# EAGLE design bus-blaster-case (EAGLE 5.11)
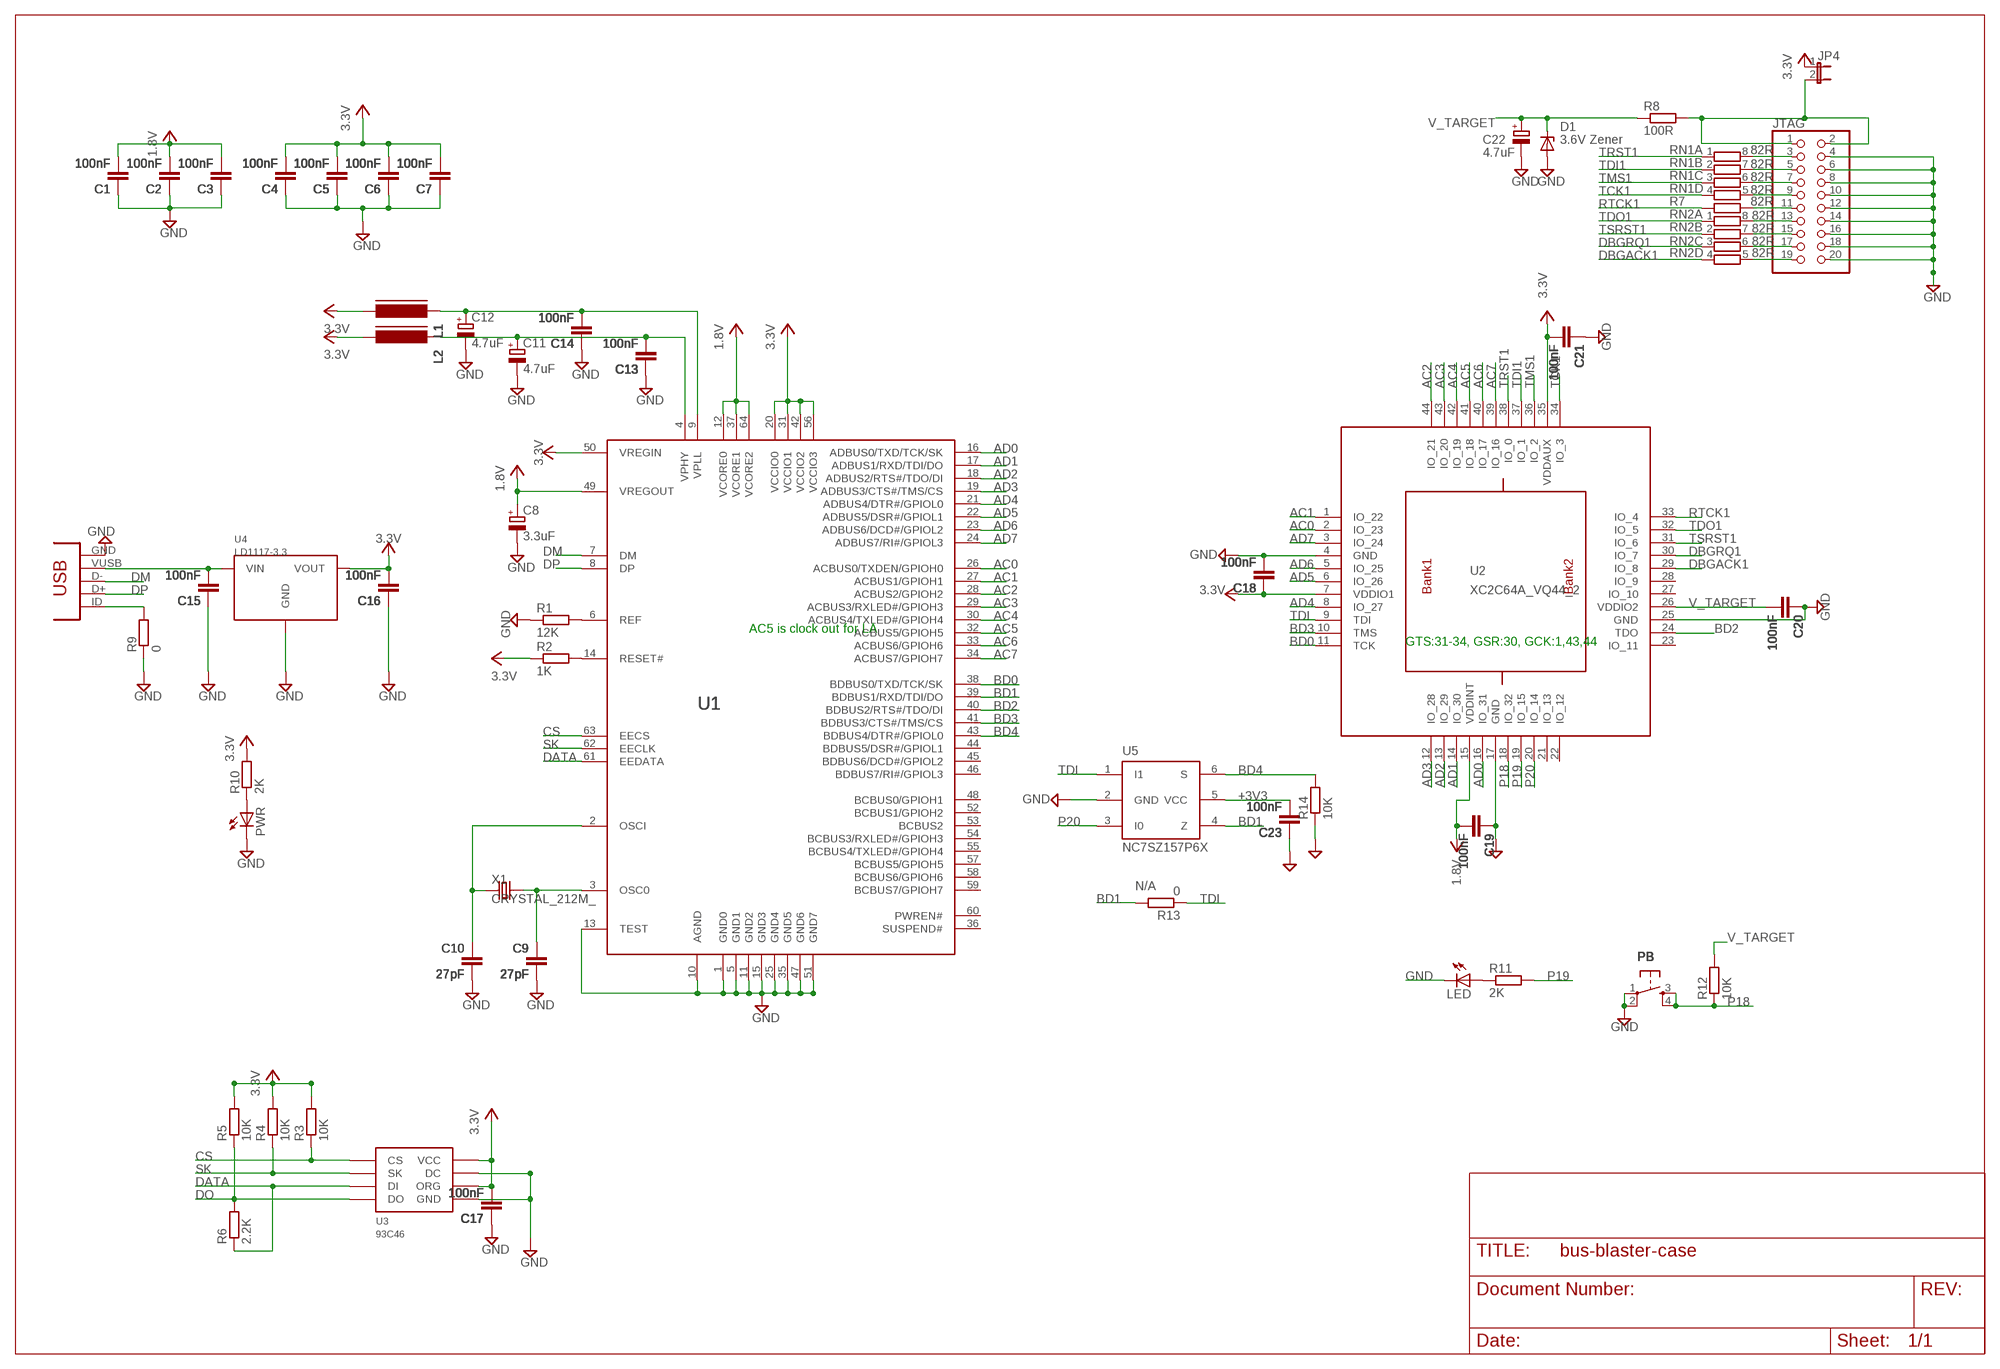
[diagram p0: schematic, sheet 1]

## Parts
C1  100nF  CAPC603  [C603]
C2  100nF  CAPC603  [C603]
C3  100nF  CAPC603  [C603]
C4  100nF  CAPC603  [C603]
C5  100nF  CAPC603  [C603]
C6  100nF  CAPC603  [C603]
C7  100nF  CAPC603  [C603]
C8  3.3uF  CAP_POLSMC_A  [SMC_A]
C9  27pF  CAPC603  [C603]
C10  27pF  CAPC603  [C603]
C11  4.7uF  CAP_POLSMC_A  [SMC_A]
C12  4.7uF  CAP_POLSMC_A  [SMC_A]
C13  100nF  CAPC603  [C603]
C14  100nF  CAPC603  [C603]
C15  100nF  CAPC603  [C603]
C16  100nF  CAPC603  [C603]
C17  100nF  CAPC603  [C603]
C18  100nF  CAPC603  [C603]
C19  100nF  CAPC603  [C603]
C20  100nF  CAPC603  [C603]
C21  100nF  CAPC603  [C603]
C22  4.7uF  CAP_POLSMC_A  [SMC_A]
C23  100nF  CAPC603  [C603]
D1  3.6V Zener  ZENERSOD-123  [SOD-123]
JP4  JP1E  [JP1]
JTAG  PINHD-2X10-SMD-INLINE  [PINHD-2X10-SMD-INLINE]
L1  FERRITE_BEAD603  [FB603]
L2  FERRITE_BEAD603  [FB603]
LED  LED3MM  [LED3MM]
PB  SW-SMD-SMALL  [TACT_SWITCH_SMALL]
PWR  LED3MM  [LED3MM]
R1  12K  RESISTORR603  [R603]
R2  1K  RESISTORR603  [R603]
R3  10K  RESISTORR603  [R603]
R4  10K  RESISTORR603  [R603]
R5  10K  RESISTORR603  [R603]
R6  2.2K  RESISTORR603  [R603]
R7  82R  RESISTORR603  [R603]
R8  100R  RESISTORR1206  [R1206]
R9  0  RESISTORR603  [R603]
R10  2K  RESISTORR603  [R603]
R11  2K  RESISTORR603  [R603]
R12  10K  RESISTORR603  [R603]
R13  0  RESISTORR603  [R603]
R14  10K  RESISTORR603  [R603]
RN1  82R  RNETWORK  [RN8P-4R-CRA06S]
RN2  82R  RNETWORK  [RN8P-4R-CRA06S]
U1  FT2232H  [LQFP64]
U2  XC2C64A_VQ44_2  [VQ44]
U3  93C46  [SOIC8]
U4  LD1117-3.3  [SOT223]
U5  NC7SZ157P6X  [SC70]
USB  CON-USB-MINI-BUSB1  [CONN_USB_MINI-B]
X1  CRYSTAL_212M_  [4X6]

## Nets
1.8V: C1.2 C2.2 C3.2 C8.+ C19.2 U1.12(VCORE0) U1.37(VCORE1) U1.49(VREGOUT) U1.64(VCORE2) U2.15(VDDINT)
+3V3: C4.2 C5.2 C6.2 C7.2 C16.2 C17.2 C18.1 C21.2 C23.2 JP4.1 L1.2 L2.2 R2.1 R3.2 R4.2 R5.2 R10.2 U1.20(VCCIO0) U1.31(VCCIO1) U1.42(VCCIO2) U1.50(VREGIN) U1.56(VCCIO3) U2.7(VDDIO1) U2.35(VDDAUX) U3.6(ORG) U3.8(VCC) U4.2(VOUT) U5.5(VCC) ; supply symbol labelled 3.3V
AC0: U1.26(ACBUS0/TXDEN/GPIOH0) U2.2(IO_23)
AC1: U1.27(ACBUS1/GPIOH1) U2.1(IO_22)
AC2: U1.28(ACBUS2/GPIOH2) U2.44(IO_21)
AC3: U1.29(ACBUS3/RXLED#/GPIOH3) U2.43(IO_20)
AC4: U1.30(ACBUS4/TXLED#/GPIOH4) U2.42(IO_19)
AC5: U1.32(ACBUS5/GPIOH5) U2.41(IO_18)
AC6: U1.33(ACBUS6/GPIOH6) U2.40(IO_17)
AC7: U1.34(ACBUS7/GPIOH7) U2.39(IO_16)
AD0: U1.16(ADBUS0/TXD/TCK/SK) U2.16(IO_31)
AD1: U1.17(ADBUS1/RXD/TDI/DO) U2.14(IO_30)
AD2: U1.18(ADBUS2/RTS#/TDO/DI) U2.13(IO_29)
AD3: U1.19(ADBUS3/CTS#/TMS/CS) U2.12(IO_28)
AD4: U1.21(ADBUS4/DTR#/GPIOL0) U2.8(IO_27)
AD5: U1.22(ADBUS5/DSR#/GPIOL1) U2.6(IO_26)
AD6: U1.23(ADBUS6/DCD#/GPIOL2) U2.5(IO_25)
AD7: U1.24(ADBUS7/RI#/GPIOL3) U2.3(IO_24)
BD0: U1.38(BDBUS0/TXD/TCK/SK) U2.11(TCK)
BD1: R13.2 U1.39(BDBUS1/RXD/TDI/DO) U5.4(Z)
BD2: U1.40(BDBUS2/RTS#/TDO/DI) U2.24(TDO)
BD3: U1.41(BDBUS3/CTS#/TMS/CS) U2.10(TMS)
BD4: R14.2 U1.43(BDBUS4/DTR#/GPIOL0) U5.6(S)
CS: R3.1 U1.63(EECS) U3.1(CS)
DATA: R6.1 U1.61(EEDATA) U3.3(DI)
DBGACK1: RN2.4 U2.29(IO_8)
DBGRQ1: RN2.3 U2.30(IO_7)
DM: U1.7(DM) USB.D-
DO: R5.1 R6.2 U3.4(DO)
DP: U1.8(DP) USB.D+
GND: C1.1 C2.1 C3.1 C4.1 C5.1 C6.1 C7.1 C8.- C9.2 C10.2 C11.- C12.- C13.1 C14.1 C15.1 C16.1 C17.1 C18.2 C19.1 C20.1 C21.1 C22.- C23.1 D1.A JTAG.4 JTAG.6 JTAG.8 JTAG.10 JTAG.12 JTAG.14 JTAG.16 JTAG.18 JTAG.20 LED.K(C) PB.1 PB.2 PWR.K(C) R1.1 R9.1 R14.1 U1.1(GND0) U1.5(GND1) U1.10(AGND) U1.11(GND2) U1.13(TEST) U1.15(GND3) U1.25(GND4) U1.35(GND5) U1.47(GND6) U1.51(GND7) U2.4(GND) U2.17(GND) U2.25(GND) U3.5(GND) U3.7(DC) U4.1(GND) U5.2(GND) USB.GND
N$1: C9.1 U1.3(OSC0) X1.2(X2)
N$2: C10.1 U1.2(OSCI) X1.1(X1)
N$3: R2.2 U1.14(RESET#)
N$4: R1.2 U1.6(REF)
N$5: C15.2 U4.3(VIN) USB.VUSB
N$6: PWR.A R10.1
N$7: JTAG.3 RN1.8
N$8: LED.A R11.1
N$9: JTAG.5 RN1.7
N$10: JTAG.7 RN1.6
N$11: JTAG.9 RN1.5
N$12: JTAG.11 R7.2
N$13: JTAG.13 RN2.8
N$14: JTAG.15 RN2.7
N$15: JTAG.17 RN2.6
N$16: JTAG.19 RN2.5
N$19: R9.2 USB.ID(USBID)
P18: PB.3 PB.4 R12.1 U2.18(IO_32)
P19: R11.2 U2.19(IO_15)
P20: U2.20(IO_14) U5.3(I0)
RTCK1: R7.1 U2.33(IO_4)
SK: R4.1 U1.62(EECLK) U3.2(SK)
TCK1: RN1.4 U2.34(IO_3)
TDI: R13.1 U2.9(TDI) U5.1(I1)
TDI1: RN1.2 U2.37(IO_1)
TDO1: RN2.1 U2.32(IO_5)
TMS1: RN1.3 U2.36(IO_2)
TRST1: RN1.1 U2.38(IO_0)
TSRST1: RN2.2 U2.31(IO_6)
V_TARGET: C20.2 C22.+ D1.C R8.1 R12.2 U2.26(VDDIO2)
V_TARGET_UNREG: JP4.2 JTAG.1 JTAG.2 R8.2
VPHY: C11.+ C13.2 L2.1 U1.4(VPHY)
VPLL: C12.+ C14.2 L1.1 U1.9(VPLL)
Unconnected: U1.36(SUSPEND#) U1.44(BDBUS5/DSR#/GPIOL1) U1.45(BDBUS6/DCD#/GPIOL2) U1.46(BDBUS7/RI#/GPIOL3) U1.48(BCBUS0/GPIOH1) U1.52(BCBUS1/GPIOH2) U1.53(BCBUS2) U1.54(BCBUS3/RXLED#/GPIOH3) U1.55(BCBUS4/TXLED#/GPIOH4) U1.57(BCBUS5/GPIOH5) U1.58(BCBUS6/GPIOH6) U1.59(BCBUS7/GPIOH7) U1.60(PWREN#) U2.21(IO_13) U2.22(IO_12) U2.23(IO_11) U2.27(IO_10) U2.28(IO_9) USB.BODY@1(BODY) USB.BODY@2(BODY) USB.BODY@3(BODY) USB.BODY@4(BODY)

## Notes on the sheet
- AC5 is clock out for LA
- GTS:31-34, GSR:30, GCK:1,43,44
- N/A

## Library data of the parts
C1-C7 C9 C10 C13-C21 C23 = dp_devices:CAP
C8 C11 C12 C22 = DP-EagleLibrary:CAP_POL
D1 = dp_devices:ZENER: Zener Diode SOD-323
JP4 = jumper:JP1E: JUMPER
JTAG = bus-blaster-case:PINHD-2X10-SMD-INLINE: PIN HEADER
L1 L2 = dp_devices:FERRITE_BEAD
LED PWR = led:LED: LED OSRAM: - CHIPLED LG R971, LG N971, LY N971, LG Q971, LY Q971, LO R971, LY R971 LH N974, LH R974 LS Q976, LO Q976, LY Q976 LO Q996 - Hyper CHIPLED LW Q18S LB Q993, LB Q99A, LB R99A - SideLED LS A670, LO A670, LY A670, LG A670, LP A670 LB A673, LV A673, LT A673, LW A673 LH A674 LY A675 LS A676, LA A676, LO A676, LY A676, LW A676 LS A679, LY A679, LG A679 - Hyper Micro SIDELED® LS Y876, LA Y876, LO Y876, LY Y876 LT Y87S - SmartLED LW L88C, LW L88S LB L89C, LB L89S, LG L890 LS L89K, LO L89K, LY L89K LS L896, LA L896, LO L896, LY L896 - TOPLED LS T670, LO T670, LY T670, LG T670, LP T670 LSG T670, LSP T670, LSY T670, LOP T670, LYG T670 LG T671, LOG T671, LSG T671 LB T673, LV T673, LT T673, LW T673 LH T674 LS T676, LA T676, LO T676, LY T676, LB T676, LH T676, LSB T676, LW T676 LB T67C, LV T67C, LT T67C, LS T67K, LO T67K, LY T67K, LW E67C LS E67B, LA E67B, LO E67B, LY E67B, LB E67C, LV E67C, LT E67C LW T67C LS T679, LY T679, LG T679 LS T770, LO T770, LY T770, LG T770, LP T770 LB T773, LV T773, LT T773, LW T773 LH T774 LS E675, LA E675, LY E675, LS T675 LS T776, LA T776, LO T776, LY T776, LB T776 LHGB T686 LT T68C, LB T68C - Hyper Mini TOPLED® LB M676 - Mini TOPLED Santana® LG M470 LS M47K, LO M47K, LY M47K Source: http://www.osram.convergy.de LUXEON: - LUMILED® LXK2-PW12-R00, LXK2-PW12-S00, LXK2-PW14-U00, LXK2-PW14-V00 LXK2-PM12-R00, LXK2-PM12-S00, LXK2-PM14-U00 LXK2-PE12-Q00, LXK2-PE12-R00, LXK2-PE12-S00, LXK2-PE14-T00, LXK2-PE14-U00 LXK2-PB12-K00, LXK2-PB12-L00, LXK2-PB12-M00, LXK2-PB14-N00, LXK2-PB14-P00, LXK2-PB14-Q00 LXK2-PR12-L00, LXK2-PR12-M00, LXK2-PR14-Q00, LXK2-PR14-R00 LXK2-PD12-Q00, LXK2-PD12-R00, LXK2-PD12-S00 LXK2-PH12-R00, LXK2-PH12-S00 LXK2-PL12-P00, LXK2-PL12-Q00, LXK2-PL12-R00 Source: www.luxeon.com KINGBRIGHT: KA-3528ASYC Source: www.kingbright.com
PB = dp_devices:SW-SMD-SMALL
R1-R14 = dp_devices:RESISTOR
RN1 RN2 = dp_devices:RNETWORK: 4 Resistor Array 0603
U1 = dp_devices:FT2232H: DUAL HIGH SPEED USB TO MULTIPURPOSE UART/FIFO IC
U2 = bus-blaster-case:XC2C64A_VQ44_2: xc2c32a_vq44-ian edit this description Auto generated by make-symbol-device-package-bsdl.ulp Rev. 29 Source: xc2c32a_vq44-ian.bsd
U3 = DP-EagleLibrary:93C46
U4 = DP-EagleLibrary:LD1117-3.3
U5 = bus-blaster-case:NC7SZ157P6X
USB = bus-blaster-case:CON-USB-MINI-B: USB connector
X1 = dp_devices:CRYSTAL_2

## Board
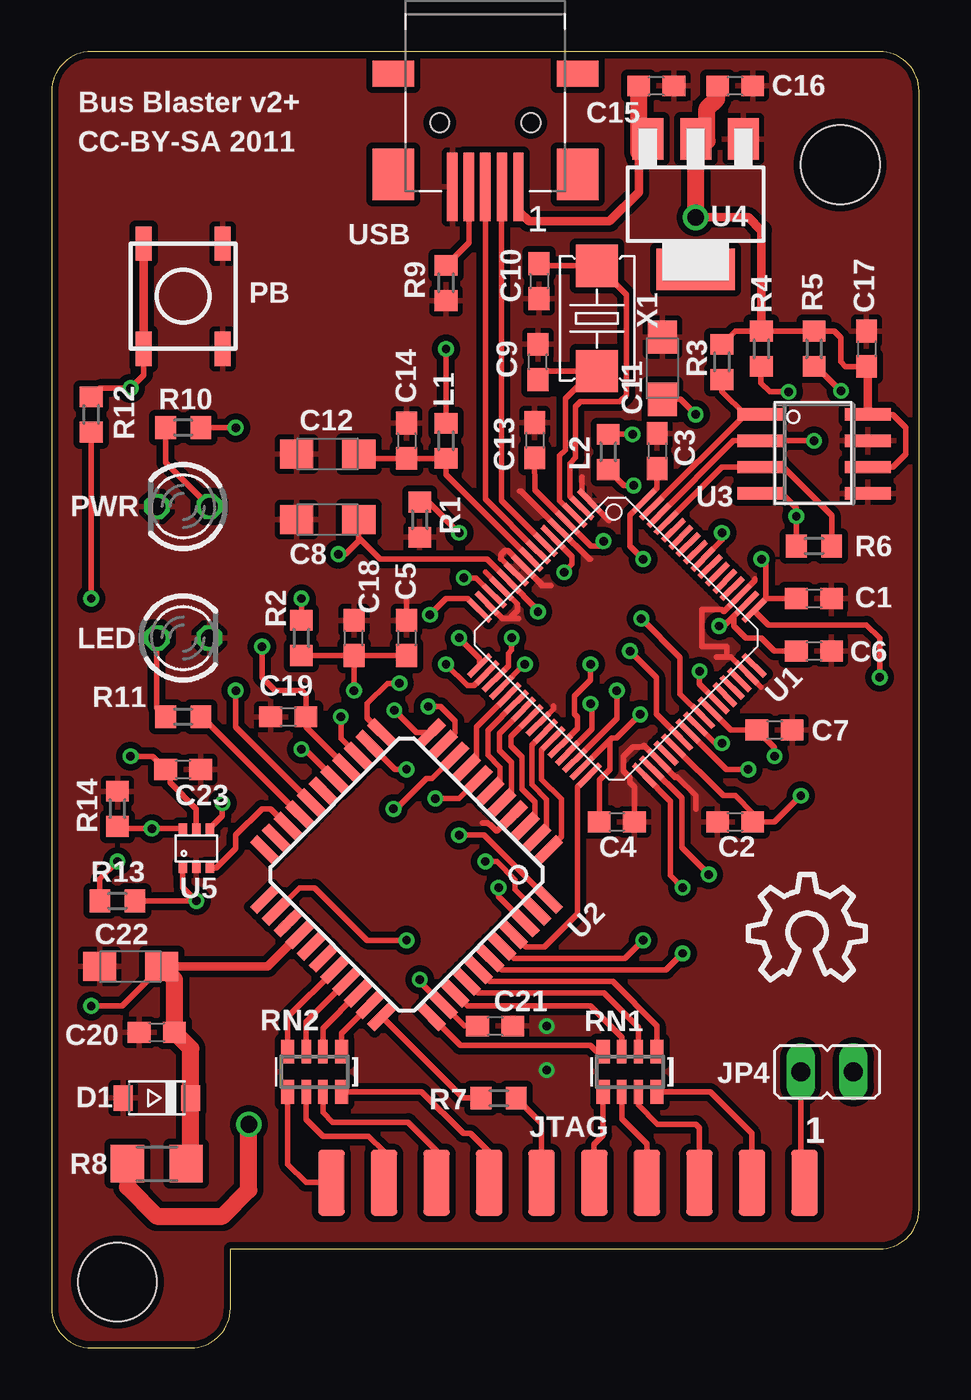
[diagram p1: board, top side]
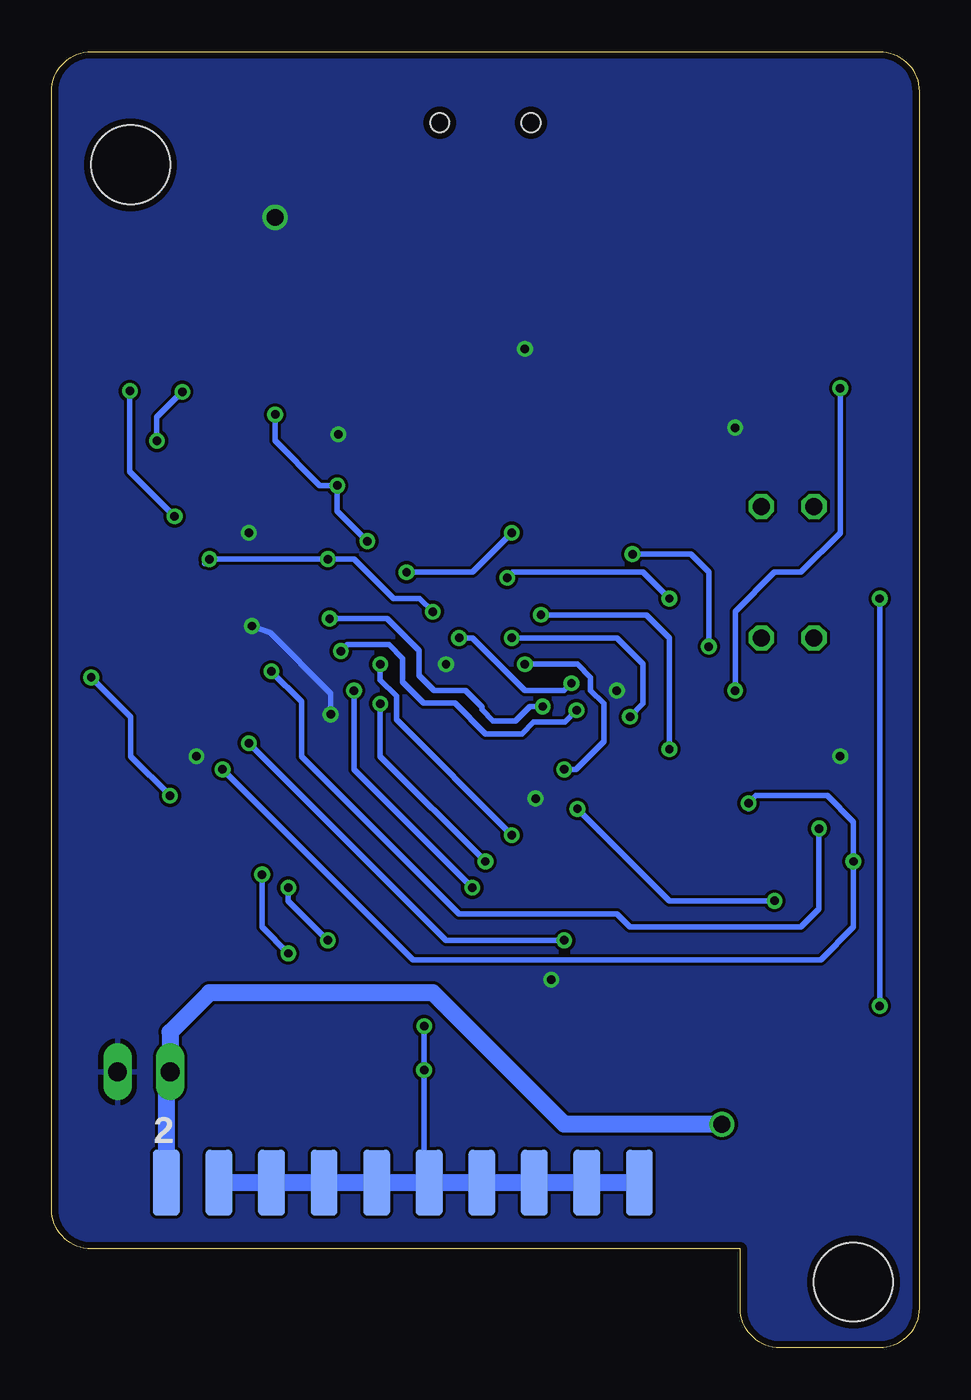
[diagram p2: board, bottom side, seen from below]

Size 41.91 x 62.61 mm. Coordinates in mm from the lower left corner, seen from the top.
Outline: 8.64,4.78 40.01,4.78 arc90 41.91,6.68 41.91,60.71 arc90 40.01,62.61 1.91,62.61 arc90 0,60.71 0,1.91 arc90 1.91,0 6.73,0 arc90 8.64,1.91 8.64,4.78
Copper layers (1*16): Top 0.0356mm / dielectric 1.5011mm / Bottom 0.0356mm
Design rules "LaenPCBOrder *": minimum track width 6mil, minimum drill 13mil, track to track 6mil, track to pad 6mil, pad to pad 6mil, via to via 6mil, smd to smd 6mil, copper to edge 13mil, drill to drill 6mil, minimum pad ring 7mil, minimum via ring 7mil, stop-mask expansion 4mil, vias tented up to drill 18mil, thermal gap 10mil
Holes 3.81 mm at 3.17,3.17 38.1,57.15

### Footprints (pad centres in the part's own frame; a part is rotated, then mirrored left to right if it is on the bottom)
C603 = smd 1.1 x 1: 1 -0.85,0; 2 0.85,0
SMC_A = smd 1.6 x 1.4: + -1.5,0; - 1.5,0
SOD-123 = smd 0.91 x 1.22: A 1.635,0; C -1.635,0
JP1 = drill 0.914 long: 1 0,-1.27; 2 0,1.27
PINHD-2X10-SMD-INLINE = smd 1.27 x 3.175: 1 11.43,0; 3 8.89,0; 5 6.35,0; 7 3.81,0; 9 1.27,0; 11 -1.27,0; 13 -3.81,0; 15 -6.35,0; 17 -8.89,0; 19 -11.43,0 | smd 1.27 x 3.175 bottom: 2 11.43,0; 4 8.89,0; 6 6.35,0; 8 3.81,0; 10 1.27,0; 12 -1.27,0; 14 -3.81,0; 16 -6.35,0; 18 -8.89,0; 20 -11.43,0
FB603 = smd 1 x 1.1: 1 -0.85,0; 2 0.85,0
LED3MM = drill 0.813 octagon: A -1.27,0; K 1.27,0
TACT_SWITCH_SMALL = smd 1.651 x 0.762: 1 -2.54,1.905; 2 2.54,1.905; 3 -2.54,-1.905; 4 2.54,-1.905
R603 = smd 1 x 1.1: 1 -0.85,0; 2 0.85,0
R1206 = smd 1.6 x 1.803: 1 -1.422,0; 2 1.422,0
RN8P-4R-CRA06S = smd 0.63 x 1.15: 1 -1.295,-0.975; 4 1.295,-0.975; 5 1.295,0.975; 8 -1.295,0.975 | smd 0.44 x 1.15: 2 -0.4,-0.975; 3 0.4,-0.975; 6 0.4,0.975; 7 -0.4,0.975
LQFP64 = smd 1.45 x 0.27: 1 -5.625,3.75; 2 -5.625,3.25; 3 -5.625,2.75; 4 -5.625,2.25; 5 -5.625,1.75; 6 -5.625,1.25; 7 -5.625,0.75; 8 -5.625,0.25; 9 -5.625,-0.25; 10 -5.625,-0.75; 11 -5.625,-1.25; 12 -5.625,-1.75; 13 -5.625,-2.25; 14 -5.625,-2.75; 15 -5.625,-3.25; 16 -5.625,-3.75; 33 5.625,-3.75; 34 5.625,-3.25; 35 5.625,-2.75; 36 5.625,-2.25; 37 5.625,-1.75; 38 5.625,-1.25; 39 5.625,-0.75; 40 5.625,-0.25; 41 5.625,0.25; 42 5.625,0.75; 43 5.625,1.25; 44 5.625,1.75; 45 5.625,2.25; 46 5.625,2.75; 47 5.625,3.25; 48 5.625,3.75 | smd 0.27 x 1.45: 17 -3.75,-5.625; 18 -3.25,-5.625; 19 -2.75,-5.625; 20 -2.25,-5.625; 21 -1.75,-5.625; 22 -1.25,-5.625; 23 -0.75,-5.625; 24 -0.25,-5.625; 25 0.25,-5.625; 26 0.75,-5.625; 27 1.25,-5.625; 28 1.75,-5.625; 29 2.25,-5.625; 30 2.75,-5.625; 31 3.25,-5.625; 32 3.75,-5.625; 49 3.75,5.625; 50 3.25,5.625; 51 2.75,5.625; 52 2.25,5.625; 53 1.75,5.625; 54 1.25,5.625; 55 0.75,5.625; 56 0.25,5.625; 57 -0.25,5.625; 58 -0.75,5.625; 59 -1.25,5.625; 60 -1.75,5.625; 61 -2.25,5.625; 62 -2.75,5.625; 63 -3.25,5.625; 64 -3.75,5.625
VQ44 = smd 1.5 x 0.5: 1 -5.7,4; 2 -5.7,3.2; 3 -5.7,2.4; 4 -5.7,1.6; 5 -5.7,0.8; 6 -5.7,0; 7 -5.7,-0.8; 8 -5.7,-1.6; 9 -5.7,-2.4; 10 -5.7,-3.2; 11 -5.7,-4; 23 5.7,-4; 24 5.7,-3.2; 25 5.7,-2.4; 26 5.7,-1.6; 27 5.7,-0.8; 28 5.7,0; 29 5.7,0.8; 30 5.7,1.6; 31 5.7,2.4; 32 5.7,3.2; 33 5.7,4 | smd 0.5 x 1.5: 12 -4,-5.7; 13 -3.2,-5.7; 14 -2.4,-5.7; 15 -1.6,-5.7; 16 -0.8,-5.7; 17 0,-5.7; 18 0.8,-5.7; 19 1.6,-5.7; 20 2.4,-5.7; 21 3.2,-5.7; 22 4,-5.7; 34 4,5.7; 35 3.2,5.7; 36 2.4,5.7; 37 1.6,5.7; 38 0.8,5.7; 39 0,5.7; 40 -0.8,5.7; 41 -1.6,5.7; 42 -2.4,5.7; 43 -3.2,5.7; 44 -4,5.7
SOIC8 = smd 0.6 x 2.2: 1 -1.905,-2.6; 2 -0.635,-2.6; 3 0.635,-2.6; 4 1.905,-2.6; 5 1.905,2.6; 6 0.635,2.6; 7 -0.635,2.6; 8 -1.905,2.6
SOT223 = smd 1.5 x 2: 1 -2.3,-3.15; 2 0,-3.15; 3 2.3,-3.15 | smd 3.8 x 2: 4 0,3.15
SC70 = smd 0.4 x 0.5: 1 -0.65,-0.95; 2 0,-0.95; 3 0.65,-0.95; 4 0.65,0.95; 5 0,0.95; 6 -0.65,0.95
CONN_USB_MINI-B = smd 2 x 2.5: BODY@1 -4.45,2.5; BODY@2 4.45,2.5 | smd 2 x 1.25: BODY@3 4.45,-2.375; BODY@4 -4.45,-2.375 | smd 0.5 x 3.3: D+ 0,3.1; D- -0.8,3.1; GND 1.6,3.1; ID 0.8,3.1; VUSB -1.6,3.1 | hole 0.9: -2.2,0; 2.2,0
4X6 = smd 2.032 x 2.032: 1 -2.54,0; 2 2.54,0

### Placement (x,y rotation side)
C1  36.83,36.2 180 top
C2  33.02,25.4 0 top
C3  29.25,43.32 270 top
C4  27.3,25.4 180 top
C5  17.14,34.29 270 top
C6  36.83,33.66 180 top
C7  34.92,29.84 180 top
C8  13.34,40.01 180 top
C9  23.5,47.62 90 top
C10  23.54,51.53 270 top
C11  29.5,47.32 90 top
C12  13.34,43.18 180 top
C13  23.34,43.84 270 top
C14  17.14,43.81 270 top
C15  29.21,60.96 180 top
C16  33.02,60.96 180 top
C17  39.37,48.26 270 top
C18  14.61,34.29 90 top
C19  11.43,30.48 0 top
C20  5.08,15.24 0 top
C21  21.42,15.54 180 top
C22  3.81,18.41 180 top
C23  6.35,27.94 180 top
D1  5.08,12.06 180 top
JP4  37.47,13.34 90 top
JTAG  24.94,7.98 0 top
L1  19.05,43.81 90 top
L2  26.88,43.28 90 top
LED  6.35,34.29 0 top
PB  6.35,50.8 270 top
PWR  6.35,40.64 180 top
R1  17.78,40.01 90 top
R2  12.06,34.29 90 top
R3  32.38,47.62 90 top
R4  34.29,48.26 90 top
R5  36.83,48.26 90 top
R6  36.83,38.73 180 top
R7  21.59,12.06 0 top
R8  5.08,8.89 180 top
R9  19.05,51.44 90 top
R10  6.35,44.45 0 top
R11  6.35,30.48 0 top
R12  1.91,45.09 270 top
R13  3.17,21.59 180 top
R14  3.17,26.04 270 top
RN1  27.94,13.34 180 top
RN2  12.7,13.34 180 top
U1  27.3,34.29 315 top
U2  17.14,22.86 225 top
U3  36.83,43.18 270 top
U4  31.11,55.24 180 top
U5  6.99,24.13 0 top
U$1  [OSHW_10X200_NOTEXT]  33.66,17.78 0 top
USB  20.95,59.18 180 top
X1  26.34,49.73 270 top

### Tracks (layer width: path | path; a pad name or v marks a point on that pad's centre or on a via)
1.8V  (via drill 0.41)
  Top 0.254: U2.15 12.28,29.99 C19.2 | 34.51,36.2 U1.49 34.62,34.92 39.37,34.92 40.01,34.29 v40.01,32.38 | 34.51,36.2 C1.2 | C3.2 29.25,41.54 U1.64 27.94,40.23 27.94,38.73 v28.57,38.1 | v23.5,35.56 23.5,35.62 U1.12 21.02,38.1 15.88,38.1 14.84,39.14 C8.+ 14.84,38.97 14.21,38.34 v13.85,38.34 | 34.51,36.2 34.51,37.88 v34.29,38.1 | C19.2 | v10.16,33.87 10.16,32.38 10.79,31.75 12.06,31.75 12.28,31.54 C19.2 | U1.37 32.45,26.67 33.02,26.67 33.87,25.82 C2.2 34.92,25.4 v36.2,26.67
  Bottom 0.254: v23.5,35.56 24.13,36.2 25.4,36.2 27.3,38.1 v28.57,38.1 v34.29,38.1 34.51,37.88 | v10.16,33.87 10.16,37.47 11.03,38.34 v13.85,38.34 | v40.01,32.38 38.1,30.48 38.1,28.57 v36.2,26.67
+3V3  (via drill 0.41, 0.81)
  Top 0.254: C17.2 38.35,47.41 38.13,47.63 38.13,48.8 37.82,49.11 R5.2 R4.2 33.02,49.11 R3.2 | L2.2 27.07,44.13 v28.06,44.13 | C21.2 19.94,15.54 U2.35 17.78,17.7 v17.78,17.78 | C18.1 v14.61,31.75 | U1.20 v22.85,33.02 v22.86,33.02 | R10.2 v8.89,44.45 | U1.42 32.81,29.84 C7.2 34.92,29 v34.92,28.57 | 32.95,35.34 U1.50 | 32.95,35.34 32.95,34.87 | C6.2 34.92,33.66 34.29,34.29 33.54,34.29 32.95,34.87 | 32.95,34.87 32.95,34.86 | 26.93,29.31 U1.31 | 26.93,29.31 27.06,29.45 27.28,29.45 v28.43,30.6 | C4.2 26.45,27.42 26.96,27.93 26.96,29.28 26.93,29.31 | U2.7 19.69,26.53 v18.53,26.53 | U1.56 32.38,39.02 v32.38,39.37 | R2.1 C18.1 | C18.1 C5.2 | U3.8 40.64,45.09 41.27,44.45 41.27,43.18 40.64,42.55 U3.6 | v32.24,34.87 32.48,34.87 32.95,35.34 | L1.2 v19.05,48.26 | U5.5 6.99,26.04 5.71,27.3 5.71,27.73 C23.2 4.87,28.57 v3.81,28.57
  Top 0.406: U3.8 39.43,47.35 C17.2 | v31.11,54.61 33.66,54.61 34.29,53.98 R4.2
  Top 0.813: C16.2 32.13,60.33 31.67,59.86 31.67,58.31 U4.2 v31.11,54.61
  Bottom 0.254: v32.24,34.87 31.37,34.54 28.43,31.61 v28.43,30.6
  pour Bottom: 8.64,4.78 40.01,4.8 arc90 41.91,6.7 41.91,60.71 arc90 40.01,62.61 1.91,62.61 arc90 0,60.71 0,1.91 arc90 1.91,0 6.73,0 arc90 8.64,1.91
AC0
  Top 0.254: U1.26 23.2,29.11 23.2,27.2 23.91,26.48 23.91,25.09 23.45,24.63 U2.2
AC1
  Top 0.254: U1.27 23.67,28.88 23.67,27.45 24.64,26.51 24.64,24.71 24,24.07 U2.1
AC2  (via drill 0.41)
  Top 0.254: U1.28 25.4,29.91 25.4,30.48 25.26,30.62 25.26,31.48 26.04,32.26 v26.04,33.02 | U2.44 20.9,24.77 v19.68,24.77
  Bottom 0.254: v19.68,24.77 25.26,30.34 25.26,31.48 26.04,32.26 v26.04,33.02
AC3  (via drill 0.41)
  Top 0.254: U1.29 26.1,29.9 26.1,31.11 v26.04,31.11 | U2.43 22.39,22.14 22.39,22.61 21.51,23.5 v20.95,23.5
  Bottom 0.254: v20.95,23.5 26.04,28.57 v26.04,31.11
AC4  (via drill 0.41)
  Top 0.254: U1.30 27.3,30.4 v27.3,31.75 | U2.42 21.59,21.81 v21.59,22.23
  Bottom 0.254: v21.59,22.23 27.3,27.94 v27.3,31.75
AC5
  Top 0.254: U1.32 25.4,27.08 25.4,20.95 23.81,19.36 22.91,19.36 U2.41 | U2.41
AC6  (via drill 0.41)
  Top 0.254: U2.40 22.33,18.8 27.69,18.8 v28.57,19.68 | U1.33 29.9,26.4 29.9,22.81 v30.48,22.23
  Bottom 0.254: v30.48,22.23 30.48,21.59 v28.57,19.68
AC7  (via drill 0.41)
  Top 0.254: U2.39 21.76,18.25 29.68,18.25 v30.48,19.05 | U1.34 30.44,26.56 30.44,24.17 v31.75,22.86
  Bottom 0.254: v31.75,22.86 31.75,20.32 v30.48,19.05
AD0  (via drill 0.41)
  Top 0.254: U1.16 20.1,36.2 19.05,36.2 v18.27,35.42 v18.27,35.41 | U2.16 12.22,28.92 v12.06,28.92
  Bottom 0.254: v18.27,35.41 13.19,35.41 12.06,34.29 v12.06,28.92
AD1  (via drill 0.41)
  Top 0.254: U2.14 13.97,29.43 v13.97,30.48 | U1.17 20.68,33.3 v19.68,34.29
  Bottom 0.254: v13.97,30.48 13.34,31.11 13.34,33.02 14.61,34.29 v19.68,34.29
AD2  (via drill 0.41)
  Top 0.254: U2.13 16.59,27.94 v17.14,27.94 | U1.18 20.41,31.99 20.08,31.99 v19.05,33.02
  Bottom 0.254: v19.05,33.02 16.51,33.02 15.88,32.38 15.88,31.75 15.24,31.11 15.24,29.29 U2.13 16.59,27.94 v17.14,27.94
AD3  (via drill 0.41)
  Top 0.254: U1.19 22.07,32.94 22.07,33.54 22.23,33.7 v22.23,34.29 | U2.12 15.24,30.42 15.24,31.11 16.23,32.1 v16.8,32.1
  Bottom 0.254: v16.8,32.1 17.15,31.75 19.05,31.75 21.59,34.29 v22.23,34.29
AD4
  Top 0.254: U1.21 20.52,29.98 20.52,28.51 U2.8
AD5
  Top 0.254: U2.6 21.67,27.39 21.67,28.04 21.08,28.64 21.08,29.83 U1.22
AD6
  Top 0.254: U1.23 21.64,29.68 21.64,28.86 22.22,28.27 22.22,26.8 U2.5
AD7
  Top 0.254: U1.24 22.19,29.53 22.19,29.07 22.72,28.54 22.72,27 23.34,26.38 23.34,25.66 U2.3
BD0  (via drill 0.41)
  Top 0.254: U1.38 29.21,30.62 29.21,32.38 v27.94,33.66 | U2.11 17.63,29.72 v16.55,30.8
  Bottom 0.254: v16.55,30.8 17.12,30.23 18.62,30.23 19.2,29.66 20.95,29.66 22.43,31.14 23.94,31.14 24.95,32.16 24.95,33.3 25.62,33.97 27.63,33.97 v27.94,33.66
BD1  (via drill 0.41)
  Top 0.254: v3.17,23.5 2.33,22.64 R13.2 | U1.39 32.59,27.94 v33.66,27.94 | U5.4 8.24,25.69 v8.24,26.31
  Bottom 0.254: v33.66,27.94 24.45,18.74 4.76,18.74 3.17,20.32 v3.17,23.5 3.17,25.4 4.45,26.67 7.88,26.67 v8.24,26.31 8.24,26.02
BD2  (via drill 0.41)
  Top 0.254: U1.40 32.03,29.21 v32.38,29.21 | U2.24 11.98,22.23 12.7,22.23 15.24,19.68 v17.14,19.68
  Bottom 0.254: v17.14,19.68 22.86,19.68 v32.38,29.21
BD3  (via drill 0.41)
  Top 0.254: U2.10 19.49,29.73 19.49,30.28 18.8,30.98 v18.19,30.98 | U1.41 30.35,31.59 30.35,33.36 v28.49,35.23
  Bottom 0.254: v18.19,30.98 18.8,30.98 19.49,30.28 20.58,30.28 21.13,30.83 21.13,30.95 21.92,31.75 23.43,31.75 24.17,32.48 24.17,33.69 25.7,35.23 v28.49,35.23
BD4  (via drill 0.41)
  Top 0.254: R14.2 3.28,25.08 3.29,25.09 v4.83,25.09 U5.6 | U1.43 31.3,32.06 v31.3,32.68
  Bottom 0.254: v31.3,32.68 29.84,31.22 29.84,28.57 22.23,20.95 14.61,20.95 13.97,20.32 5.71,20.32 4.83,21.2 v4.83,25.09
CS
  Top 0.254: U1.63 33.5,45.09 | 33.5,45.09 U3.1 | 33.5,45.09 32.38,46.2 R3.1
DATA
  Top 0.254: U1.61 32.38,42.55 U3.3 35.35,42.55 37.68,40.21 R6.1
DBGACK1
  Top 0.254: U2.29 11.4,15.99 RN2.4
DBGRQ1
  Top 0.254: U2.30 12.3,15.75 RN2.3
DM
  Top 0.254: 21.74,55.59 21.7,54.76 | 21.74,55.59 USB.D- | U1.7 21.74,40.92 21.74,55.59
DO  (via drill 0.41)
  Top 0.254: U3.4 35.27,41.27 35.98,40.57 v35.98,40.16 R6.2 | 36.83,47.37 R5.1 36.95,47.41 v38.14,46.22
  Bottom 0.254: v35.98,40.16 38.14,42.32 v38.14,46.22
DP
  Top 0.254: U1.8 20.95,40.99 USB.D+
GND  (via drill 0.41)
  Top 0.254: 34.27,31.92 U1.47 32.82,33.37 32.61,33.37 | 33.97,37.13 33.97,37.07 U1.51 32.47,35.57 32.38,35.66 31.43,35.66 31.43,33.87 32.61,33.87 32.61,33.37 | U1.11 21.73,38.1 21.69,38.1 21.71,38.12 21.71,38.32 21.9,38.51 22.04,38.51 23.66,36.89 23.66,36.81 | U1.13 | 21.04,35.95 21.03,35.96 U1.15 21.77,35.23 22.11,35.23 | U1.35 28.61,29.1 28.6,29.1 | 28.6,29.1 30.12,27.58 | 30.12,27.58 30.12,27.56 | U1.25 24.23,30.87 | 24.23,30.87 24.24,30.87 | 25.61,42.05 25.61,41.28 U1.1 26.93,39.96 | U1.13 20.95,37.47 | U1.13 22.49,35.93 22.49,35.62 22.11,35.23 | C5.1 17.14,36.2 | C4.1 28.16,27.09 27.94,27.3 27.94,27.55 27.62,27.87 27.62,28.57 28.08,29.04 28.54,29.04 28.6,29.1 | 31.11,26.04 31.11,26.67 30.21,27.58 30.12,27.58 | 32.61,33.37 32.1,33.37 | U2.4 21.5,24.96 21.17,25.28 21.14,25.28 21.07,25.34 20.81,25.34 | U1.10 23.7,36.83 24.13,36.83 | 22.6,41.39 22.68,41.39 U1.5 25.97,38.1 26.04,38.1 | 24.23,30.87 24.23,31.01 | 22.55,35.23 22.11,35.23
  Bottom 0.254: v23.91,15.54 v23.91,13.41 v23.92,13.41 23.92,8.22 JTAG.12
  Bottom 0.813: JTAG.20 JTAG.18 JTAG.16 JTAG.14 JTAG.12 JTAG.10 JTAG.8 JTAG.6 JTAG.4
  pour Top (isolate 0.305): 8.64,4.78 40.01,4.8 arc90 41.91,6.7 41.91,60.71 arc90 40.01,62.61 1.91,62.61 arc90 0,60.71 0,1.91 arc90 1.91,0 6.73,0 arc90 8.64,1.91
N$1
  Top 0.254: C9.1 23.91,47.19 X1.2 26.16,47.19 24.82,45.84 24.82,43.37 24.54,43.1 24.54,40.94 U1.3
N$2
  Top 0.254: C10.1 23.65,52.27 X1.1 26.36,52.27 27.76,50.87 27.76,46.03 27.43,45.7 25.54,45.7 25.31,45.47 25.31,42.99 25.04,42.73 25.04,41.15 U1.2
N$3  (via drill 0.41)
  Top 0.254: R2.2 v12.06,36.2 | v19.91,37.2 20.51,37.2 U1.14
  Bottom 0.254: v12.06,36.2 13.34,37.47 19.64,37.47 v19.91,37.2
N$4  (via drill 0.41)
  Top 0.254: U1.6 25.13,38.23 25.13,37.85 24.77,37.48 v24.77,37.47 | R1.2 18.2,40.85 v19.68,39.37
  Bottom 0.254: v19.68,39.37 21.59,37.47 v24.77,37.47
N$5
  Top 0.406: USB.VUSB 22.55,54.91 23.05,54.42 26.96,54.42 28.36,55.83 28.36,57.76
  Top 0.813: U4.3 28.36,57.76 C15.2
N$6
  Top 0.254: PWR.A 5.5,42.76 R10.1
N$7
  Top 0.254: RN1.8 31.81,12.36 33.83,10.35 JTAG.3
N$8
  Top 0.254: R11.1 5.08,30.9 LED.A
N$9
  Top 0.254: JTAG.5 31.29,10.62 31.11,10.79 29.27,10.79 28.34,11.72 RN1.7
N$10
  Top 0.254: JTAG.7 28.75,9.86 27.54,11.07 RN1.6
N$11
  Top 0.254: RN1.5 26.64,10.27 26.21,9.84 JTAG.9
N$12
  Top 0.254: R7.2 23.67,10.83 JTAG.11
N$13
  Top 0.254: RN2.8 17.88,12.36 19.89,10.35 20.24,10.35 21.14,9.45 JTAG.13
N$14
  Top 0.254: RN2.7 13.1,11.36 13.57,10.89 17.22,10.89 18.59,9.52 JTAG.15
N$15
  Top 0.254: RN2.6 12.3,11.03 13.1,10.22 15.31,10.22 16.05,9.48 JTAG.17
N$16
  Top 0.254: RN2.5 11.4,8.86 12.29,7.98 JTAG.19
N$19
  Top 0.254: USB.ID 20.16,53.39 R9.2
P18  (via drill 0.41)
  Top 0.254: U2.18 8.89,29.98 v8.89,31.75 | 2.33,45.94 R12.1 2.33,46.35 v3.81,46.35 4.45,46.99 PB.4
  Top 0.406: PB.4 PB.3
  Bottom 0.254: v8.89,31.75 8.89,35.56 6.99,37.47 5.71,37.47 3.81,39.37 v3.81,46.35
P19
  Top 0.254: U2.19 7.26,30.48 R11.2
P20
  Top 0.254: U2.20 10.58,26.04 10.16,26.04 8.89,24.77 8.89,24.13 7.94,23.18 U5.3
RTCK1
  Top 0.254: R7.1 19.88,12.06 U2.33
SK  (via drill 0.41)
  Top 0.254: U1.62 32.94,43.81 U3.2 v36.83,43.81 | v35.6,46.18 34.7,46.18 34.27,46.61 34.27,47.39 R4.1
  Bottom 0.254: v36.83,43.81 36.83,44.95 v35.6,46.18
TCK1
  Top 0.254: U2.34 19.74,14.61 26.04,14.61 26.33,14.31 RN1.4
TDI  (via drill 0.41)
  Top 0.254: U2.9 18.38,27.49 18.1,27.49 16.64,26.04 v16.51,26.04 | U5.1 6.33,22.24 v6.99,21.59 R13.1
  Bottom 0.254: v16.51,26.04 12.06,21.59 v6.99,21.59
TDI1
  Top 0.254: U2.37 20.6,17.14 26.67,17.14 28.34,15.47 RN1.2
TDO1
  Top 0.254: U2.32 13.99,15.18 RN2.1
TMS1
  Top 0.254: U2.36 20.1,16.51 26.04,16.51 27.54,15.01 RN1.3
TRST1
  Top 0.254: U2.38 21.18,17.69 27.1,17.69 29.23,15.56 RN1.1
TSRST1
  Top 0.254: U2.31 13.1,15.42 RN2.2
V_TARGET  (via drill 0.41)
  Top 0.254: v1.91,36.2 R12.2 | v1.91,16.51 3.4,16.51 C22.+
  Top 0.406: U2.26 10.44,18.41 C22.+
  Top 0.813: R8.1 6.71,9.1 D1.C 6.71,14.46 C20.2 5.93,17.8 C22.+
  Bottom 0.254: v1.91,16.51 v1.91,36.2
V_TARGET_UNREG  (via drill 0.81)
  Top 0.254: JP4.2 36.2,8.15 JTAG.2
  Top 0.813: R8.2 3.66,7.77 5.08,6.35 8.26,6.35 9.53,7.62 v9.53,10.79
  Bottom 0.813: v9.53,10.79 17.14,10.79 23.5,17.14 34.29,17.14 36.2,15.24 JP4.2 36.37,13.16 JTAG.2
VPHY  (via drill 0.41)
  Top 0.254: C13.2 23.34,41.43 U1.4 26.04,38.73 26.43,38.73 v26.66,38.97 | L2.1 27.65,41.66 v28.11,41.66 | C11.+ 30.38,45.82 v31.11,45.09
  Bottom 0.254: v31.11,45.09 31.11,43.81 28.96,41.66 v28.11,41.66 28.11,40.42 v26.66,38.97
VPLL
  Top 0.254: C12.+ 15.05,42.97 C14.2 L1.1 19.05,42.19 U1.9

### Text on the board
tPlace: Bus Blaster v2+ | CC-BY-SA 2011